# Altium schematic sheet control_circuit.SchDoc
size A0; SheetNumber: 1; SheetTotal: 1
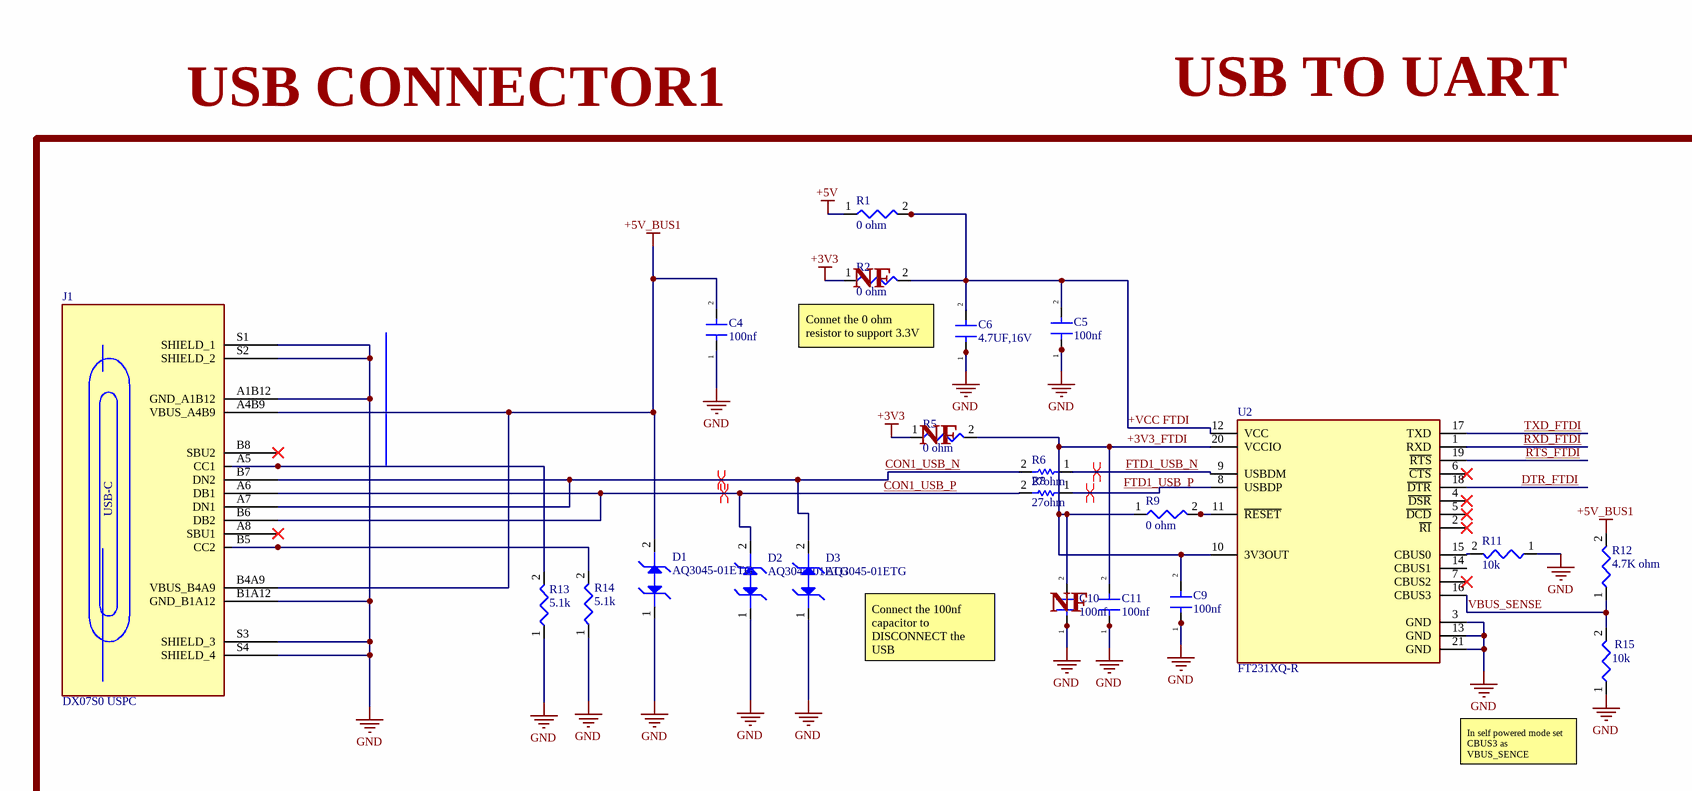
[diagram p0: control_circuit.SchDoc, top left]
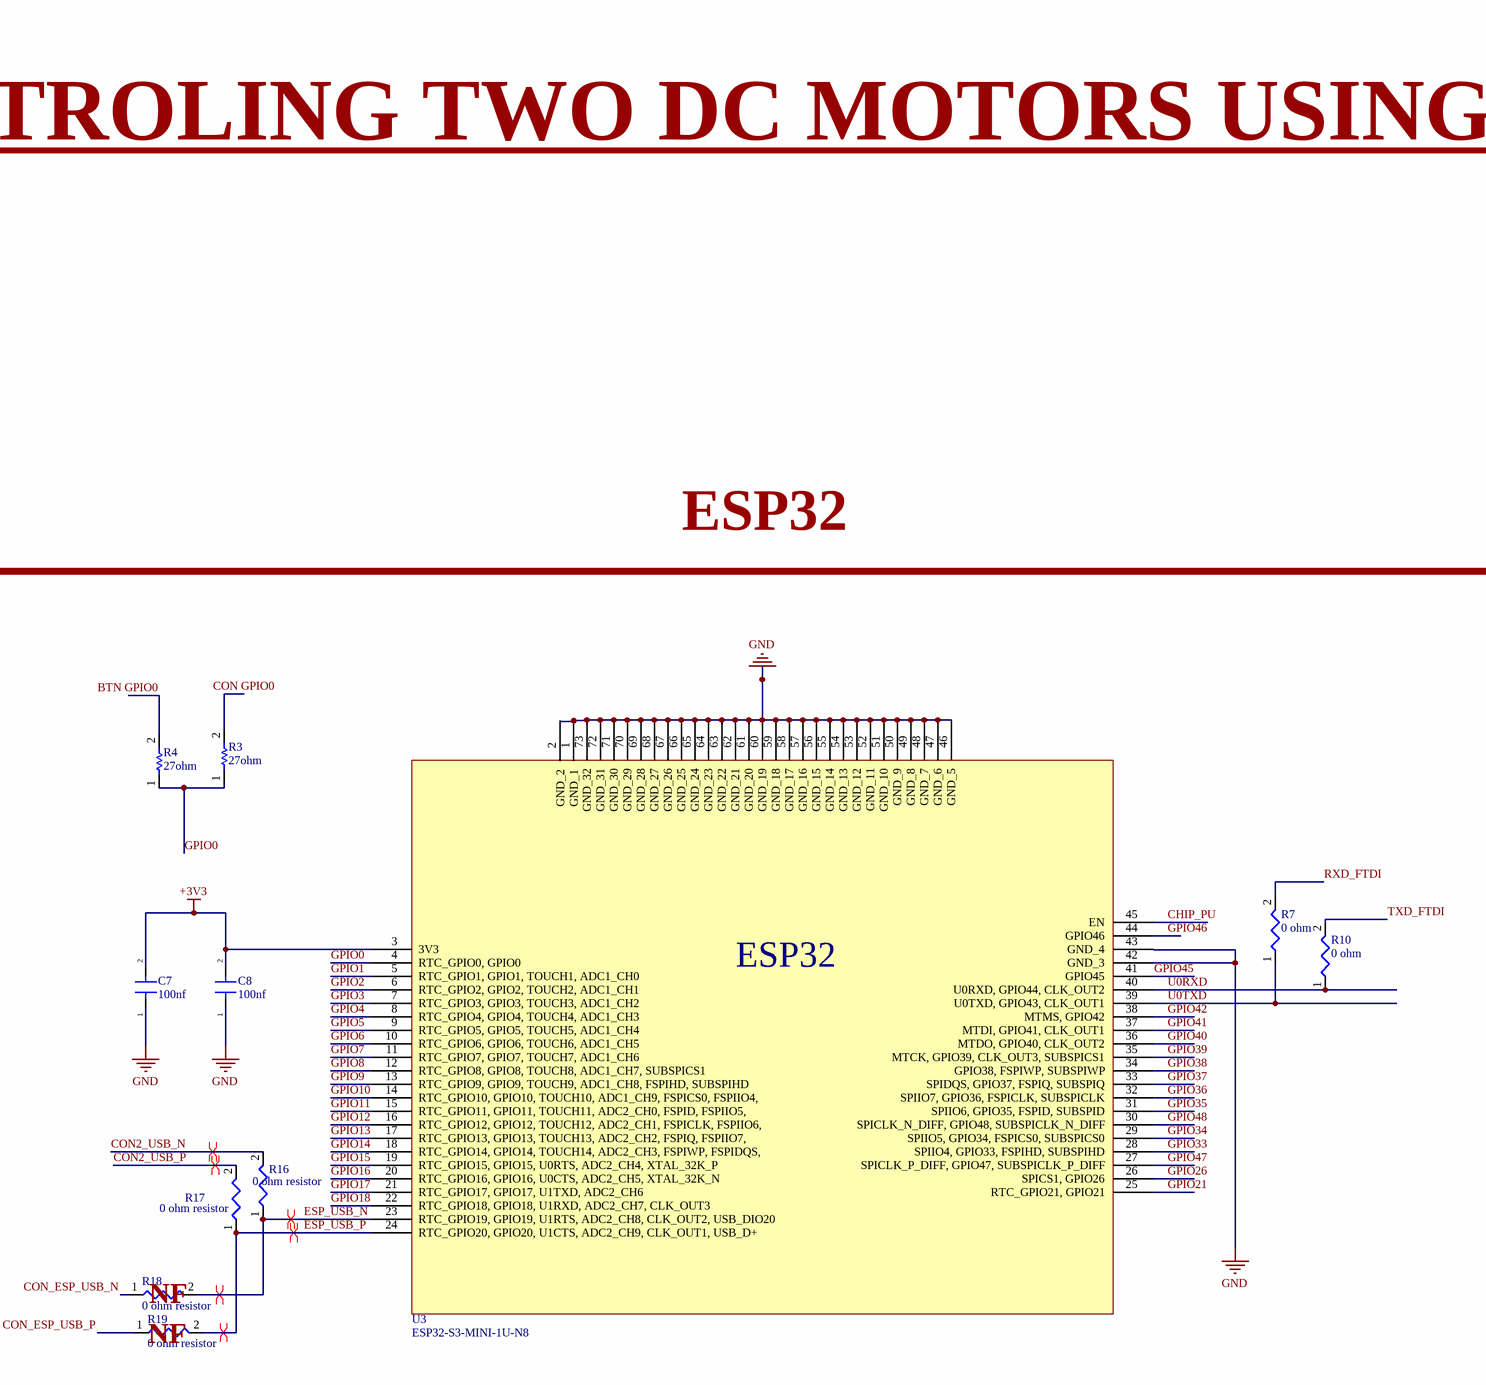
[diagram p1: control_circuit.SchDoc, top middle]
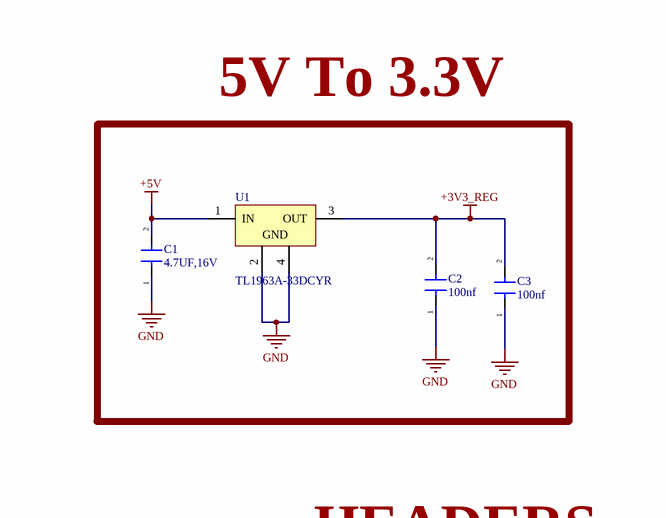
[diagram p2: control_circuit.SchDoc, top right]
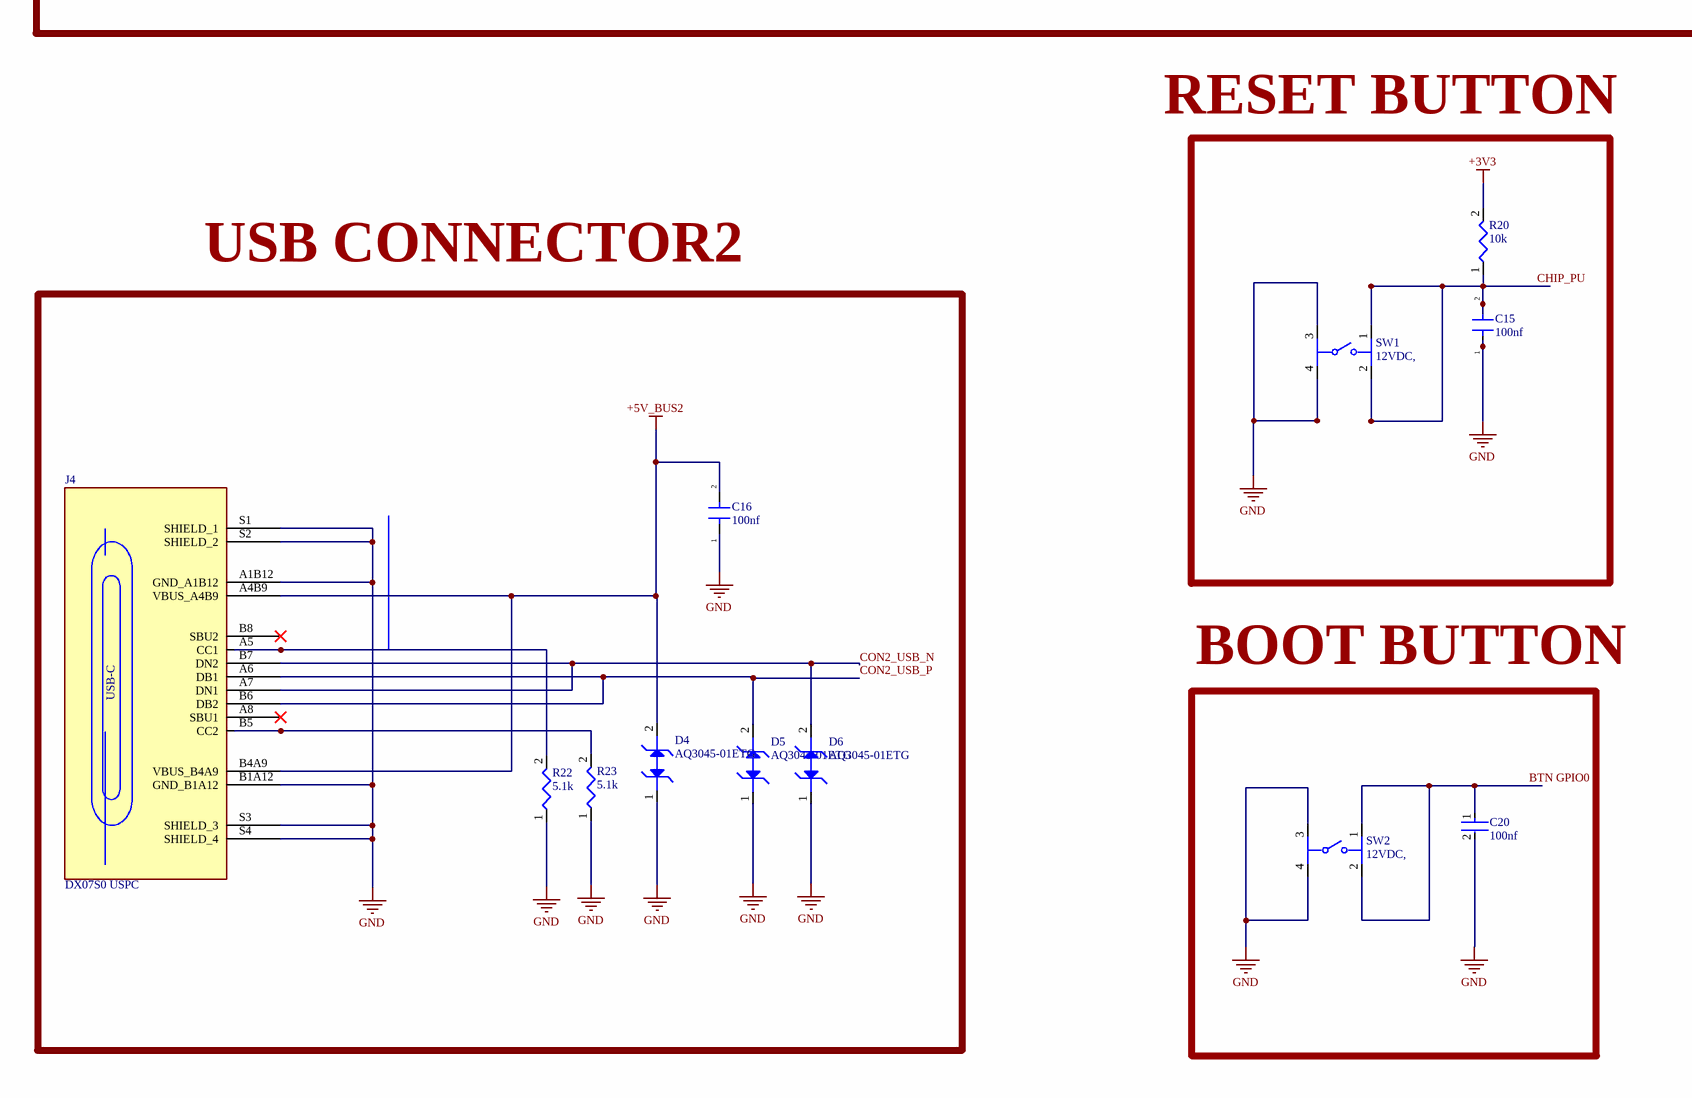
[diagram p3: control_circuit.SchDoc, bottom left]
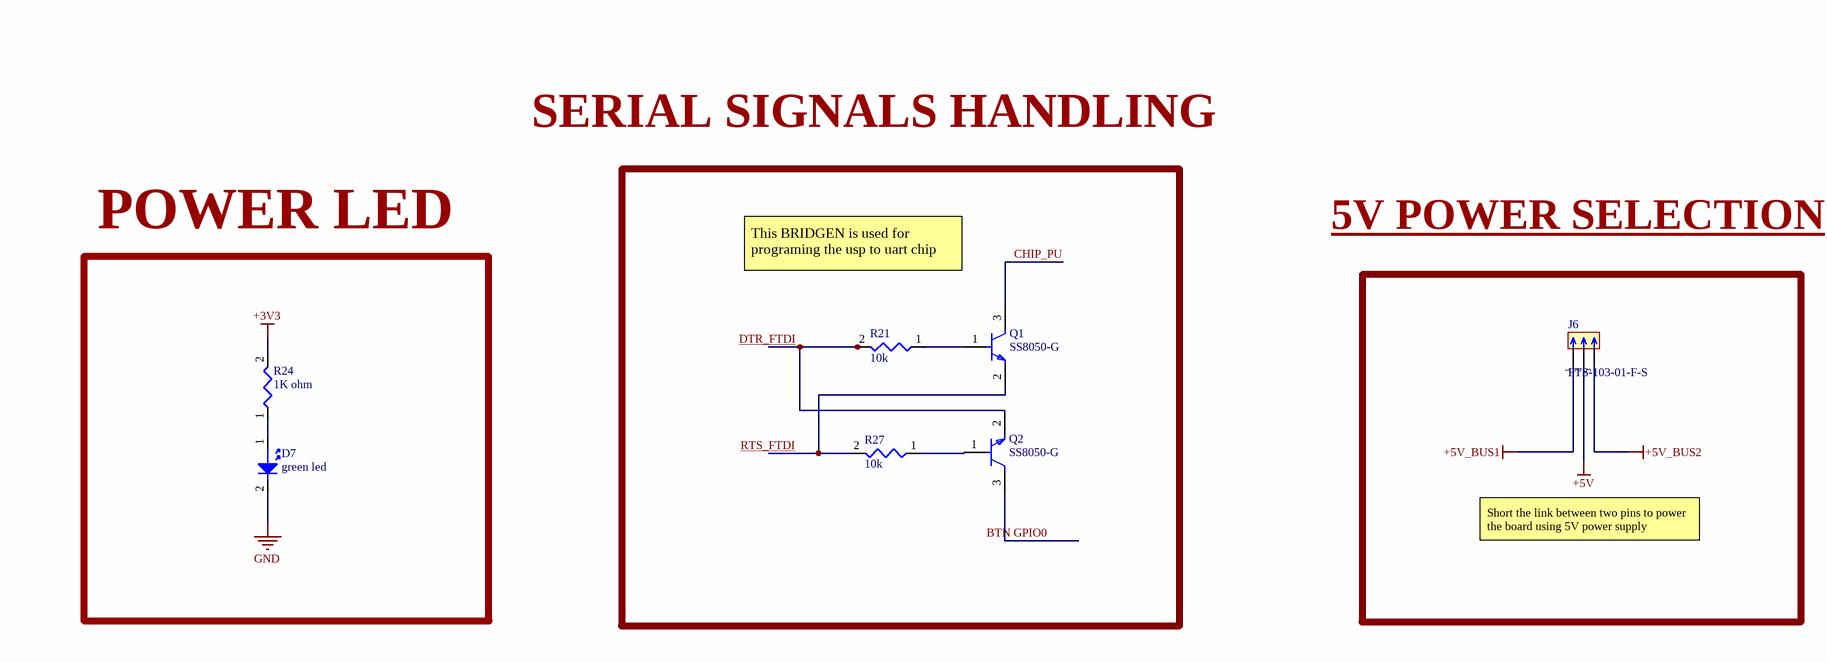
[diagram p4: control_circuit.SchDoc, bottom middle]
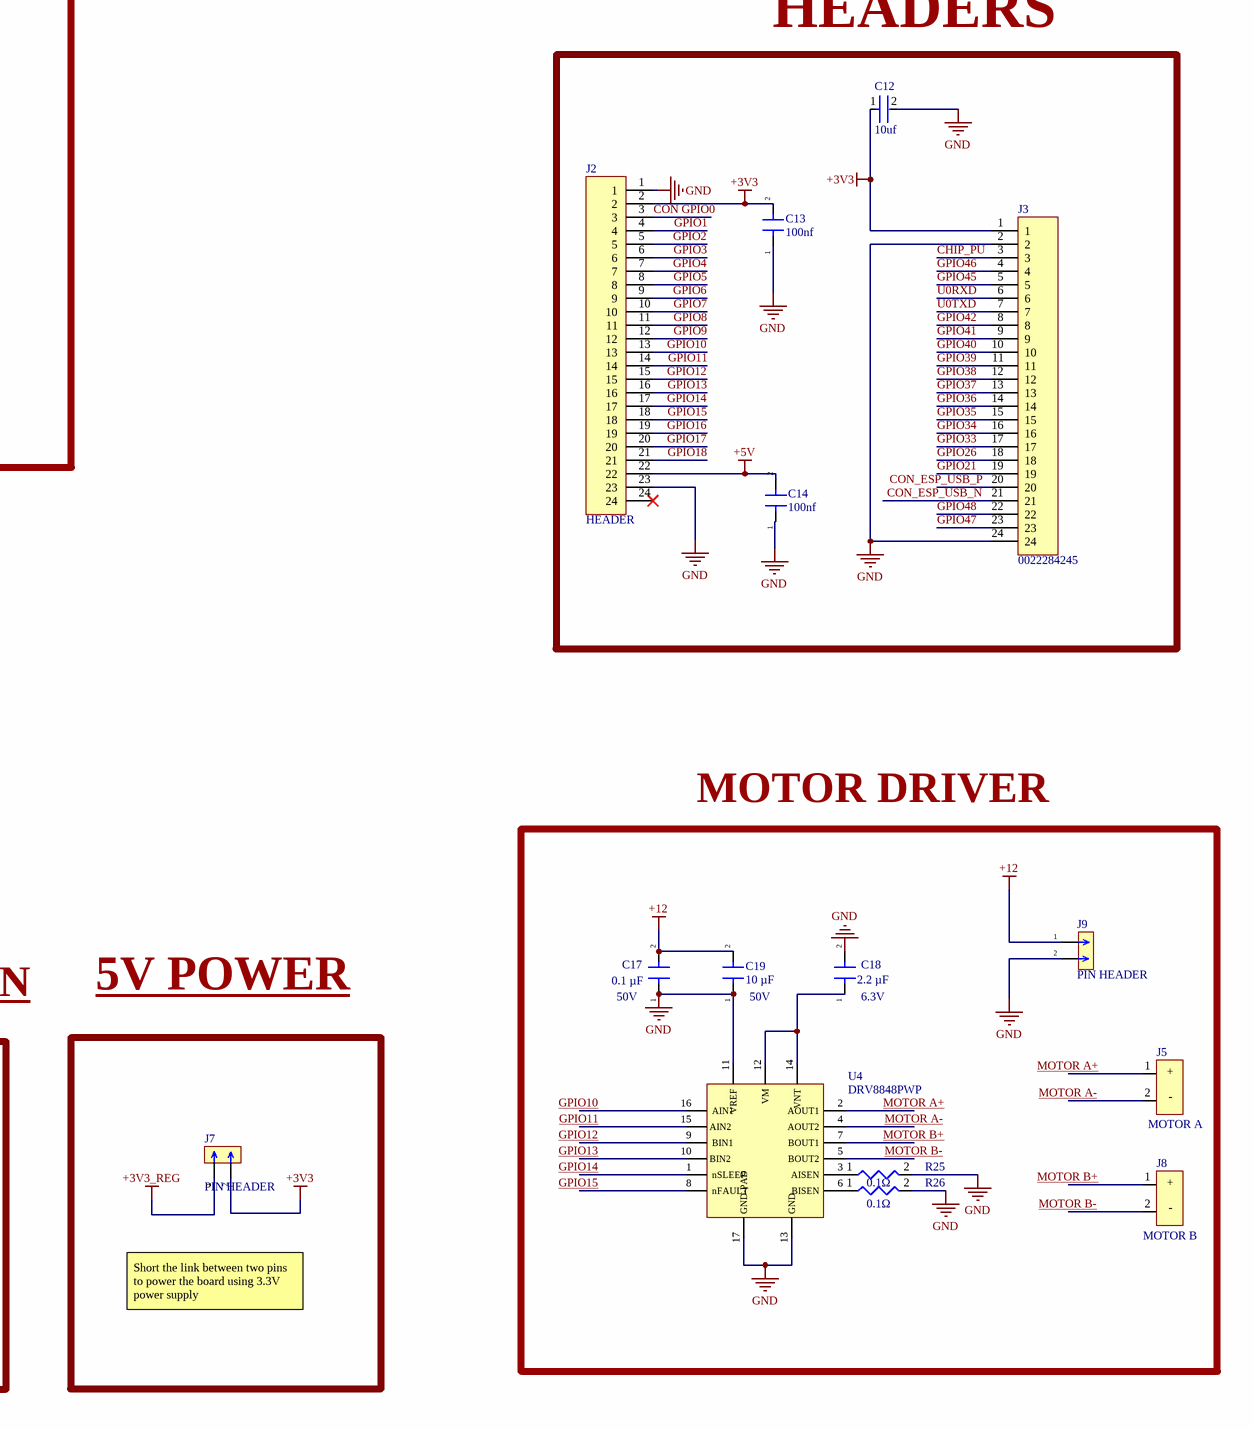
[diagram p5: control_circuit.SchDoc, bottom right]

## Parts
C1  4.7UF,16V  [4.7uf_capacitor]
C2  100nf  [0603 capacitor]
C3  100nf  [0603 capacitor]
C4  100nf  [0603 capacitor]
C5  100nf  [0603 capacitor]
C6  4.7UF,16V  [4.7uf_capacitor]
C7  100nf  [0603 capacitor]
C8  100nf  [0603 capacitor]
C9  100nf  [0603 capacitor]
C10  100nf  [0603 capacitor]
C11  100nf  [0603 capacitor]
C12  10uf  [FP-CL17-IPC_C]
C13  100nf  [0603 capacitor]
C14  100nf  [0603 capacitor]
C15  100nf  [0603 capacitor]
C16  100nf  [0603 capacitor]
C17  0.1 µF  [CAP SMD]
C18  2.2 µF  [CAP SMD]
C19  10 µF  [CAP SMD]
C20  100nf  [FP-CL17-IPC_C]
D1  AQ3045-01ETG  [SOD882]
D2  AQ3045-01ETG  [SOD882]
D3  AQ3045-01ETG  [SOD882]
D4  AQ3045-01ETG  [SOD882]
D5  AQ3045-01ETG  [SOD882]
D6  AQ3045-01ETG  [SOD882]
D7  green led  [LED0402G]
J1  DX07S0 USPC  [usp-c]
J2  HEADER  [HDR_1X24_2.54MM]
J3  0022284245  [HDR_1X24_2.54MM]
J4  DX07S0 USPC  [usp-c]
J5  MOTOR A  [header]
J6  FTS-103-01-F-S  [pin header male]
J7  PIN HEADER  [HEADER 1*2]
J8  MOTOR B  [header]
J9  PIN HEADER  [HEADER 1*2]
Q1  SS8050-G  [SS8050-G TRANSISTOR]
Q2  SS8050-G  [SS8050-G TRANSISTOR]
R1  0 ohm  [27ohm resisor smd]
R2  0 ohm  [27ohm resisor smd]
R3  27ohm  [27ohm resisor smd]
R4  27ohm  [27ohm resisor smd]
R5  0 ohm  [27ohm resisor smd]
R6  27ohm  [27ohm resisor smd]
R7  0 ohm  [27ohm resisor smd]
R8  27ohm  [27ohm resisor smd]
R9  0 ohm  [27ohm resisor smd]
R10  0 ohm  [27ohm resisor smd]
R11  10k  [SMD RESISTOR]
R12  4.7K ohm  [27ohm resisor smd]
R13  5.1k  [5.1K resistor smd]
R14  5.1k  [5.1K resistor smd]
R15  10k  [SMD RESISTOR]
R16  0 ohm resistor  [27ohm resisor smd]
R17  0 ohm resistor  [27ohm resisor smd]
R18  0 ohm resistor  [27ohm resisor smd]
R19  0 ohm resistor  [27ohm resisor smd]
R20  10k  [SMD RESISTOR]
R21  10k  [SMD RESISTOR]
R22  5.1k  [5.1K resistor smd]
R23  5.1k  [5.1K resistor smd]
R24  1K ohm  [5.1K resistor smd]
R25  0.1Ω  [SMD RESISTOR]
R26  0.1Ω  [SMD RESISTOR]
R27  10k  [SMD RESISTOR]
SW1  12VDC,  [tactile switch smd]
SW2  12VDC,  [tactile switch smd]
U1  TL1963A-33DCYR  [TL1963A-33DCYR]
U2  FT231XQ-R  [FT231XQ-R]
U3  ESP32-S3-MINI-1U-N8  [ESP32-S3-MINI-1-N8]
U4  DRV8848PWP  [DRV8848 PWP SMD]

## Blocks framed on the sheet
USB CONNECTOR1: C4-C6 C9-C11 D1-D3 J1 R1 R2 R5 R6 R8 R9 R11-R15 U2
5V To 3.3V: C1-C3 U1
HEADERS: C12-C14 J2 J3
USB CONNECTOR2: C16 D4-D6 J4 R22 R23
MOTOR DRIVER: C17-C19 J5 J8 J9 R25 R26 U4
BOOT BUTTON: C20 SW2
POWER LED: D7 R24

## Nets
+3V3: C7.2 C8.2 C12.1 C13.2 J2.2 J3.1 J7.2 R2.1 R5.1 R20.2 R24.2 U3.3(3V3)
+3V3_REG: C2.2 C3.2 J7.1 U1.3(OUT)
+5V: C1.2 C14.2 J2.22 J6.2 R1.1 U1.1(IN)
+5V_BUS1: C4.2 D1.2 J1.A4B9(VBUS_A4B9) J1.B4A9(VBUS_B4A9) J6.1 R12.2
+5V_BUS2: C16.2 D4.2 J4.A4B9(VBUS_A4B9) J4.B4A9(VBUS_B4A9) J6.3
+12: C17.2 C19.2 J9.1
GND: C1.1 C2.1 C3.1 C4.1 C5.1 C6.1 C7.1 C8.1 C9.1 C10.1 C11.1 C12.2 C13.1 C14.1 C15.1 C16.1 C17.1 C18.2 C19.1 C20.2 D1.1 D2.1 D3.1 D4.1 D5.1 D6.1 D7.2 J1.A1B12(GND_A1B12) J1.B1A12(GND_B1A12) J1.S1(SHIELD_1) J1.S2(SHIELD_2) J1.S3(SHIELD_3) J1.S4(SHIELD_4) J2.1 J2.23 J3.2 J3.24 J4.A1B12(GND_A1B12) J4.B1A12(GND_B1A12) J4.S1(SHIELD_1) J4.S2(SHIELD_2) J4.S3(SHIELD_3) J4.S4(SHIELD_4) J9.2 R11.1 R13.1 R14.1 R15.1 R22.1 R23.1 R25.2 R26.2 SW1.3 SW1.4 SW2.3 SW2.4 U1.2(GND) U1.4(GND) U2.3(GND) U2.13(GND) U2.21(GND) U3.1(GND_1) U3.2(GND_2) U3.42(GND_3) U3.43(GND_4) U3.46(GND_5) U3.47(GND_6) U3.48(GND_7) U3.49(GND_8) U3.50(GND_9) U3.51(GND_10) U3.52(GND_11) U3.53(GND_12) U3.54(GND_13) U3.55(GND_14) U3.56(GND_15) U3.57(GND_16) U3.58(GND_17) U3.59(GND_18) U3.60(GND_19) U3.61(GND_20) U3.62(GND_21) U3.63(GND_22) U3.64(GND_23) U3.65(GND_24) U3.66(GND_25) U3.67(GND_26) U3.68(GND_27) U3.69(GND_28) U3.70(GND_29) U3.71(GND_30) U3.72(GND_31) U3.73(GND_32) U4.11(VREF) U4.13(GND) U4.17(GND-PAD)
+3V3_FTDI: C9.2 C10.2 C11.2 R5.2 R9.1 U2.10(3V3OUT) U2.20(VCCIO)
+VCC FTDI: C5.2 C6.2 R1.2 R2.2 U2.12(VCC)
BTN GPIO0: C20.1 Q2.3(C) R4.2 SW2.1 SW2.2
CHIP_PU: C15.2 J3.3 Q1.3(C) R20.1 SW1.1 SW1.2 U3.45(EN)
CON1_USB_N: D3.2 J1.A7(DN1) J1.B7(DN2) R6.2
CON1_USB_P: D2.2 J1.A6(DB1) J1.B6(DB2) R8.2
CON2_USB_N: D6.2 J4.A7(DN1) J4.B7(DN2) R16.2
CON2_USB_P: D5.2 J4.A6(DB1) J4.B6(DB2) R17.2
CON GPIO0: J2.3 R3.2
CON_ESP_USB_N: J3.21 R18.1
CON_ESP_USB_P: J3.20 R19.1
DTR_FTDI: Q2.2(E) R21.2 U2.18(~{DTR})
ESP_USB_N: R16.1 R18.2 U3.23(RTC_GPIO19,_GPIO19,_U1RTS,_ADC2_CH8,_CLK_OUT2,_USB_DIO20)
ESP_USB_P: R17.1 R19.2 U3.24(RTC_GPIO20,_GPIO20,_U1CTS,_ADC2_CH9,_CLK_OUT1,_USB_D+)
FTD1_USB_N: R6.1 U2.9(USBDM)
FTD1_USB_P: R8.1 U2.8(USBDP)
GPIO0: R3.1 R4.1 U3.4(RTC_GPIO0,_GPIO0)
GPIO1: J2.4 U3.5(RTC_GPIO1,_GPIO1,_TOUCH1,_ADC1_CH0)
GPIO2: J2.5 U3.6(RTC_GPIO2,_GPIO2,_TOUCH2,_ADC1_CH1)
GPIO3: J2.6 U3.7(RTC_GPIO3,_GPIO3,_TOUCH3,_ADC1_CH2)
GPIO4: J2.7 U3.8(RTC_GPIO4,_GPIO4,_TOUCH4,_ADC1_CH3)
GPIO5: J2.8 U3.9(RTC_GPIO5,_GPIO5,_TOUCH5,_ADC1_CH4)
GPIO6: J2.9 U3.10(RTC_GPIO6,_GPIO6,_TOUCH6,_ADC1_CH5)
GPIO7: J2.10 U3.11(RTC_GPIO7,_GPIO7,_TOUCH7,_ADC1_CH6)
GPIO8: J2.11 U3.12(RTC_GPIO8,_GPIO8,_TOUCH8,_ADC1_CH7,_SUBSPICS1)
GPIO9: J2.12 U3.13(RTC_GPIO9,_GPIO9,_TOUCH9,_ADC1_CH8,_FSPIHD,_SUBSPIHD)
GPIO10: J2.13 U3.14(RTC_GPIO10,_GPIO10,_TOUCH10,_ADC1_CH9,_FSPICS0,_FSPIIO4,) U4.16(AIN1)
GPIO11: J2.14 U3.15(RTC_GPIO11,_GPIO11,_TOUCH11,_ADC2_CH0,_FSPID,_FSPIIO5,) U4.15(AIN2)
GPIO12: J2.15 U3.16(RTC_GPIO12,_GPIO12,_TOUCH12,_ADC2_CH1,_FSPICLK,_FSPIIO6,) U4.9(BIN1)
GPIO13: J2.16 U3.17(RTC_GPIO13,_GPIO13,_TOUCH13,_ADC2_CH2,_FSPIQ,_FSPIIO7,) U4.10(BIN2)
GPIO14: J2.17 U3.18(RTC_GPIO14,_GPIO14,_TOUCH14,_ADC2_CH3,_FSPIWP,_FSPIDQS,) U4.1(nSLEEP)
GPIO15: J2.18 U3.19(RTC_GPIO15,_GPIO15,_U0RTS,_ADC2_CH4,_XTAL_32K_P) U4.8(nFAULT)
GPIO16: J2.19 U3.20(RTC_GPIO16,_GPIO16,_U0CTS,_ADC2_CH5,_XTAL_32K_N)
GPIO17: J2.20 U3.21(RTC_GPIO17,_GPIO17,_U1TXD,_ADC2_CH6)
GPIO18: J2.21 U3.22(RTC_GPIO18,_GPIO18,_U1RXD,_ADC2_CH7,_CLK_OUT3)
GPIO21: J3.19 U3.25(RTC_GPIO21,_GPIO21)
GPIO26: J3.18 U3.26(SPICS1,_GPIO26)
GPIO33: J3.17 U3.28(SPIIO4,_GPIO33,_FSPIHD,_SUBSPIHD)
GPIO34: J3.16 U3.29(SPIIO5,_GPIO34,_FSPICS0,_SUBSPICS0)
GPIO35: J3.15 U3.31(SPIIO6,_GPIO35,_FSPID,_SUBSPID)
GPIO36: J3.14 U3.32(SPIIO7,_GPIO36,_FSPICLK,_SUBSPICLK)
GPIO37: J3.13 U3.33(SPIDQS,_GPIO37,_FSPIQ,_SUBSPIQ)
GPIO38: J3.12 U3.34(GPIO38,_FSPIWP,_SUBSPIWP)
GPIO39: J3.11 U3.35(MTCK,_GPIO39,_CLK_OUT3,_SUBSPICS1)
GPIO40: J3.10 U3.36(MTDO,_GPIO40,_CLK_OUT2)
GPIO41: J3.9 U3.37(MTDI,_GPIO41,_CLK_OUT1)
GPIO42: J3.8 U3.38(MTMS,_GPIO42)
GPIO45: J3.5 U3.41(GPIO45)
GPIO46: J3.4 U3.44(GPIO46)
GPIO47: J3.23 U3.27(SPICLK_P_DIFF,_GPIO47,_SUBSPICLK_P_DIFF)
GPIO48: J3.22 U3.30(SPICLK_N_DIFF,_GPIO48,_SUBSPICLK_N_DIFF)
MOTOR A+: J5.1 U4.2(AOUT1)
MOTOR A-: J5.2 U4.4(AOUT2)
MOTOR B+: J8.1 U4.7(BOUT1)
MOTOR B-: J8.2 U4.5(BOUT2)
RTS_FTDI: Q1.2(E) R27.2 U2.19(~{RTS})
RXD_FTDI: R7.2 U2.1(RXD)
TXD_FTDI: R10.2 U2.17(TXD)
U0RXD: J3.6 R10.1 U3.40(U0RXD,_GPIO44,_CLK_OUT2)
U0TXD: J3.7 R7.1 U3.39(U0TXD,_GPIO43,_CLK_OUT1)
VBUS_SENSE: R12.1 R15.2 U2.16(CBUS3)
NetC18_1: C18.1 U4.12(VM) U4.14(VNT)
NetD7_1: D7.1 R24.1
NetJ1_A5: J1.A5(CC1) R13.2
NetJ1_B5: J1.B5(CC2) R14.2
NetJ4_A5: J4.A5(CC1) R22.2
NetJ4_B5: J4.B5(CC2) R23.2
NetQ1_1: Q1.1(B) R21.1
NetQ2_1: Q2.1(B) R27.1
NetR9_2: R9.2 U2.11(~{RESET})
NetR11_2: R11.2 U2.15(CBUS0)
NetR25_1: R25.1 U4.3(AISEN)
NetR26_1: R26.1 U4.6(BISEN)

Not connected (* = marked no-connect by the designer): J1 A8(SBU1)* B8(SBU2)*; J2 24*; J4 A8(SBU1)* B8(SBU2)*; U2 2(~{RI})* 4(~{DSR})* 5(~{DCD})* 6(~{CTS})* 7(CBUS2)* 14(CBUS1)

## Layout directives
differential pair; differential pair class DIFF90: CON1_USB_N, CON1_USB_P, CON2_USB_N, CON2_USB_P, ESP_USB_N, ESP_USB_P, FTD1_USB_N, FTD1_USB_P

## Notes on the sheet
- CONTROLING TWO DC MOTORS USING ESP32
- USB TO UART
- ESP32
- (near R2) NF
- Connet the 0 ohm resistor to support 3.3V
- (near R5) NF
- (near C10) NF
- Connect the 100nf capacitor to DISCONNECT the USB
- In self powered mode set CBUS3 as VBUS_SENCE
- (near R19) NF
- (near R18) NF
- RESET BUTTON
- SERIAL SIGNALS HANDLING
- This BRIDGEN is used for programing the usp to uart chip
- 5V POWER SELECTION
- 5V POWER
- (near C17) 50V
- (near C19) 50V
- (near C18) 6.3V
- Short the link between two pins to power the board using 5V power supply
- Short the link between two pins to power the board using 3.3V power supply
- (in symbol DX07S0 USPC) USB-C
- (in symbol ESP32-S3-MINI-1U-N8) ESP32
- (in symbol terminal block_TH) +; -

## Library data of the parts
C1 C6 = CL05A475MO5NUNC: CAP CER 4.7UF 16V X5R 0402; Manufacturer: Samsung; Dielectric Material: Ceramic; Multilayer: Yes; Tolerance  (fill in as +-): 20%; Description: Ceramic Capacitor, Multilayer, Ceramic, 16V, 20% +Tol, 20% -Tol, X5R, 15% TC, 4.7uF, Surface Mount, 0402; Supplier: Digikey; Supplier Part Number: 1276-6836-6-ND; Manufacturer Part Number: CL05A475MO5NUNC; RoHS: Yes; Category: Ceramic Capacitors; Stock: 91699; Pricing: 1=0.45, 10=0.268, 50=0.1948, 100=0.1721, 500=0.1333, 1000=0.12121, 2500=0.10837, 5000=0.10058 (USD); Mounting Technology: Surface Mount; Pins: 2; Package Shape: Rectangular; Case/Package: 0402; Terminal Finish: Nickel; Min Operating Temperature: -55°C; Max Operating Temperature: 85°C; JESD-609 Code: e3; Value: 4.7uF; Capacitor Type: Ceramic; Package Style: SMTMeter; Packaging: Tape and Reel; Tolerance (fill in as +-): 20%; Rated DC Voltage (URdc): 16V; Temperature Characteristics Code: X5R; Termination: Wraparound; Length: 1mm; Width: 0.5mm; Height: 0.7mm; Reach SVHC Compliant: Yes; RoHS Compliant: Yes; ComponentLink1URL: https://datasheet.ciiva.com:443/pdfs/VipMasterIC/IC/SEMS/SEMS-S-A0008384515/SEMS-S-A0008898881-1.pdf?src-supplier=IHS+Markit; ComponentLink1Description: https://datasheet.ciiva.com:443/pdfs/VipMasterIC/IC/SEMS/SEMS-S-A0008384515/SEMS-S-A0008898881-1.pdf?src-supplier=IHS+Markit; ComponentLink2URL: http://www.farnell.com/datasheets/2710653.pdf?src-supplier=Farnell; ComponentLink2Description: http://www.farnell.com/datasheets/2710653.pdf?src-supplier=Farnell; ComponentLink3URL: http://www.samsungsem.com/kr/support/product-search/mlcc/CL05A475MO5NUNC.jsp?src-supplier=Digikey; ComponentLink3Description: http://www.samsungsem.com/kr/support/product-search/mlcc/CL05A475MO5NUNC.jsp?src-supplier=Digikey; ComponentLink4URL: http://www.farnell.com/datasheets/2710653.pdf?src-supplier=Newark; ComponentLink4Description: http://www.farnell.com/datasheets/2710653.pdf?src-supplier=Newark; ComponentLink5URL: http://www.farnell.com/datasheets/2710653.pdf?src-supplier=Element14; ComponentLink5Description: http://www.farnell.com/datasheets/2710653.pdf?src-supplier=Element14; ComponentLink6URL: https://datasheet.octopart.com/CL05A475MO5NUNC-Samsung-Electro-Mechanics-datasheet-123102911.pdf?src-supplier=Future+Electronics; ComponentLink6Description: https://datasheet.octopart.com/CL05A475MO5NUNC-Samsung-Electro-Mechanics-datasheet-123102911.pdf?src-supplier=Future+Electronics
C2-C5 C7-C11 C13-C16 = C0603C102K5RECTU: Ceramic Capacitor, Multilayer, Ceramic, 50V, 10% +Tol, 10% -Tol, X7R, 15% TC, 0.001uF, Surface Mount, 0402; Manufacturer: KEMET; Manufacturer Part Number: C0402C102K5RECTU; Supplier: Digikey; Supplier Part Number: 399-C0402C102K5RECTUCT-ND; RoHS: Yes; Stock: 8816; Pricing: 1=0.1, 10=0.046, 50=0.0314, 100=0.0269, 500=0.0194, 1000=0.01706, 2500=0.01458, 5000=0.01308 (USD); Pins: 2; Dielectric Material: Ceramic; Capacitor Type: Ceramic; Reach SVHC Compliant: Yes; RoHS Compliant: Yes; ComponentLink1URL: https://datasheet.ciiva.com:443/pdfs/VipMasterIC/IC/KEME/KEME-S-A0008958450/KEME-S-A0008958450-1.pdf?src-supplier=IHS+Markit; ComponentLink1Description: https://datasheet.ciiva.com:443/pdfs/VipMasterIC/IC/KEME/KEME-S-A0008958450/KEME-S-A0008958450-1.pdf?src-supplier=IHS+Markit
C12 C20 = CMP-13271-001069-1: Cap Ceramic 100nF 10V X7R ±10% SMD 0402 +125°C Paper T/R; Height: 0.5mm; Case/Package: 0402; Contact Plating: Tin; Case Code (Imperial): 0402; Capacitance: 100nF; Thickness: 0.022inch; Min Operating Temperature: -55°C; Package Quantity: 1; Length: 1mm; Max Operating Temperature: 125°C; Depth: 0.5mm; Voltage Rating: 10V; Packaging: Tape and Reel; Mount: Surface Mount; Tolerance: 10%; Width: 0.02inch; Radiation Hardening: No; Case Code (Metric): 1005; Dielectric: X7R
C17-C19 = capacitor smd: 22 µF ±20% 6.3V Ceramic Capacitor X5R 0603 (1608 Metric)
D1-D6 = AQ3045-01ETG: TVS DIODE 5.3VWM 12VC SOD882; Manufacturer: Littelfuse; Number of Bidirectional Channels: 1; Reverse Standoff Voltage: 5.3V; Min Breakdown Voltage: 6.8V; Peak Pulse Current: 3A; Peak Pulse Power: 40W; Power Line Protection: No; Diode Type: ZENER; Leakage Current: 100nA; Number of Channels: 1NUMBER; Description: TVS DIODE 12VC 3A SOD882 / ESD Suppressor TVS Bi-Dir 5.3V Automotive 2-Pin SOD-882 T/R; Supplier: Digikey; Supplier Part Number: F9321DKR-ND; Manufacturer Part Number: AQ3045-01ETG; RoHS: Yes; Category: TVS Diodes; Stock: 20579; Pricing: 1=0.5, 10=0.391, 100=0.2344, 500=0.217, 1000=0.14756, 2000=0.13585, 5000=0.1302 (USD); Mounting Technology: Surface Mount; Min Operating Temperature: -55°C; Max Operating Temperature: 150°C; Packaging: Cut Tape; Series: Automotive, AEC-Q101, AQ3045, SPA®; Operating Supply Voltage: 5.3V; RoHS Compliant: Yes; ComponentLink1URL: https://www.littelfuse.com/~/media/electronics/datasheets/tvs_diode_arrays/littelfuse_tvs_diode_array_aq3045_datasheet.pdf.pdf?src-supplier=Digikey; ComponentLink1Description: https://www.littelfuse.com/~/media/electronics/datasheets/tvs_diode_arrays/littelfuse_tvs_diode_array_aq3045_datasheet.pdf.pdf?src-supplier=Digikey; ComponentLink2URL: http://www.littelfuse.com/~/media/electronics/datasheets/tvs_diode_arrays/littelfuse_tvs_diode_array_aq3045_datasheet.pdf.pdf?src-supplier=Digikey; ComponentLink2Description: http://www.littelfuse.com/~/media/electronics/datasheets/tvs_diode_arrays/littelfuse_tvs_diode_array_aq3045_datasheet.pdf.pdf?src-supplier=Digikey
D7 = VLMG1500-GS08: Single Color LED, Yellow Green, 0.5mm; Manufacturer: Vishay; Color: Green,Yellow; Shape: Rectangular; Forward Current: 30mA; Forward Voltage: 2.4V; Luminous Intensity-Nom: 90mcd; Channels: 1; Reverse Voltage-Max: 5V; Viewing Angle: 130°; Overall Height: 0.35mm; Supplier: Digikey; Supplier Part Number: VLMG1500-GS08CT-ND; Manufacturer Part Number: VLMG1500-GS08; RoHS: Yes; Category: LEDs; Stock: 90862; Pricing: 1=0.34, 10=0.265, 100=0.119, 500=0.10746, 1000=0.08827 (USD); Mounting Technology: Surface Mount; Pins: 2; Color@wavelength: Green; Min Operating Temperature: -30°C; Max Operating Temperature: 85°C; Optoelectronic Device Type: SINGLE COLOR LED; Packaging: Tape and Reel; Size: 0.5mm; Terminal Pitch: 0.95mm; Reach SVHC Compliant: Yes; RoHS Compliant: Yes; ComponentLink1URL: https://datasheet.ciiva.com:443/pdfs/VipMasterIC/IC/VISH/VISH-S-A0003457490/VISH-S-A0003457490-1.pdf?src-supplier=IHS+Markit; ComponentLink1Description: https://datasheet.ciiva.com:443/pdfs/VipMasterIC/IC/VISH/VISH-S-A0003457490/VISH-S-A0003457490-1.pdf?src-supplier=IHS+Markit; ComponentLink2URL: https://datasheet.ciiva.com/12071/vlmo1500-244705-12071911.pdf?src-supplier=Mouser; ComponentLink2Description: https://datasheet.ciiva.com/12071/vlmo1500-244705-12071911.pdf?src-supplier=Mouser; ComponentLink3URL: https://datasheet.ciiva.com/30005/vlmo1500-30005134.pdf?src-supplier=Avnet; ComponentLink3Description: https://datasheet.ciiva.com/30005/vlmo1500-30005134.pdf?src-supplier=Avnet
J1 J4 = DX07S0 USPC: JAEDX07S016JA3R1500 1500 Pcs/reel; Manufacturer: JAE Electronics; Supplier: Digikey; Supplier Part Number: 670-DX07S016JA3R1500CT-ND; Manufacturer Part Number: DX07S016JA3R1500; RoHS: No; Category: USB Connectors; Stock: 3411; Pricing: 1=2.48, 10=1.891, 25=1.702, 50=1.5738, 100=1.4574, 250=1.31956, 500=1.22648 (USD); ComponentLink1URL: https://www.jae.com/direct/topics/topics_file_download/?topics_id=91780&amp;ext_no=04&amp;_lang=en&amp;v=2020041313384666992409&src-supplier=Digikey; ComponentLink1Description: https://www.jae.com/direct/topics/topics_file_download/?topics_id=91780&amp;ext_no=04&amp;_lang=en&amp;v=2020041313384666992409&src-supplier=Digikey
J2 J3 = 0022284245: CONN HEADER VERT 24POS 2.54MM; Manufacturer: Molex; Connector Type: BOARD CONNECTOR; Option: General Purpose; Filter Feature: No; Mating Information: MULTIPLE MATING PARTS AVAILABLE; Number of Rows Loaded: 1; Number of Contacts: 24; Description: Board Connector, 24 Contact(s), 1 Row(s), Male, Straight, Solder Terminal; Supplier: Digikey; Supplier Part Number: 900-0022284245-ND; Manufacturer Part Number: 0022284245; RoHS: Yes; Category: Uncategorized; Stock: 2909; Pricing: 1=1.45, 10=1.091, 100=0.8495, 500=0.73094, 1000=0.68963, 5000=0.61174, 10000=0.58469 (USD); Mounting Technology: Board; Contact Material: Brass; Contact Finish - Mating: GOLD; Contact Finish - Termination: Tin (Sn); JESD-609 Code: e3; Contact Gender: Male; Mixed Contacts: No; Mounting Style: STRAIGHT; Termination: Solder; Terminal Pitch: 2.54mm; Flammability Rating: UL94 V-0; DIN Conformance: No; IEC Conformance: No; MIL Conformance: No; Reach SVHC Compliant: Yes; RoHS Compliant: Yes; ComponentLink1URL: https://datasheet.ciiva.com:443/pdfs/VipMasterIC/IC/MOLE/MOLE-S-A0006764423/MOLE-S-A0006877704-1.pdf?src-supplier=IHS+Markit; ComponentLink1Description: https://datasheet.ciiva.com:443/pdfs/VipMasterIC/IC/MOLE/MOLE-S-A0006764423/MOLE-S-A0006877704-1.pdf?src-supplier=IHS+Markit; ComponentLink2URL: https://datasheet.ciiva.com/6814/022284363-sd-6814049.pdf?src-supplier=Digikey; ComponentLink2Description: https://datasheet.ciiva.com/6814/022284363-sd-6814049.pdf?src-supplier=Digikey; ComponentLink3URL: https://datasheet.ciiva.com/10075/0022284245-pcb-headers-10075617.pdf?src-supplier=Avnet; ComponentLink3Description: https://datasheet.ciiva.com/10075/0022284245-pcb-headers-10075617.pdf?src-supplier=Avnet; ComponentLink4URL: https://datasheet.ciiva.com/5153/0022284245-pcb-headers-228340-5153875.pdf?src-supplier=Mouser; ComponentLink4Description: https://datasheet.ciiva.com/5153/0022284245-pcb-headers-228340-5153875.pdf?src-supplier=Mouser; ComponentLink5URL: https://datasheet.ciiva.com/1433/1597854-1433759.pdf?src-supplier=Element14; ComponentLink5Description: https://datasheet.ciiva.com/1433/1597854-1433759.pdf?src-supplier=Element14
J5 J8 = terminal block_TH
J6 = FTS-103-01-F-S: CONN HEADER VERT 3POS 1.27MM; Manufacturer: Samtec; Manufacturer Series: FTS; Connector Type: BOARD CONNECTOR; Option: General Purpose; Additional Feature: Low Profile; Filter Feature: No; Number of Rows Loaded: 1; Number of Contacts: 3; Description: Board Connector, 3 Contact(s), 1 Row(s), Male, Straight, Solder Terminal; Supplier: Digikey; Supplier Part Number: 612-FTS-103-01-F-S-ND; Manufacturer Part Number: FTS-103-01-F-S; RoHS: Yes; Category: Connectors; Stock: 2922; Pricing: 1=0.73, 50=0.6378, 100=0.5407, 500=0.4491, 1000=0.4 (USD); Mounting Technology: Board; Contact Material: Bronze; Contact Finish - Mating: GOLD (3) OVER NICKEL (50); Contact Finish - Termination: Matte Tin (Sn) - with Nickel (Ni) barrier; JESD-609 Code: e3; Contact Gender: Male; Mixed Contacts: No; Mounting Style: STRAIGHT; Termination: Solder; Terminal Pitch: 1.27mm; Flammability Rating: UL94 V-0; DIN Conformance: No; IEC Conformance: No; MIL Conformance: No; Reach SVHC Compliant: Yes; RoHS Compliant: Yes; ComponentLink1URL: https://datasheet.ciiva.com:443/pdfs/VipMasterIC/IC/SAMI/SAMI-S-A0001504673/SAMI-S-A0001504673-1.pdf?src-supplier=IHS+Markit; ComponentLink1Description: https://datasheet.ciiva.com:443/pdfs/VipMasterIC/IC/SAMI/SAMI-S-A0001504673/SAMI-S-A0001504673-1.pdf?src-supplier=IHS+Markit; ComponentLink2URL: http://suddendocs.samtec.com/prints/fts-1xx-xx-xx-xx-xx-mkt.pdf?src-supplier=Digikey; ComponentLink2Description: http://suddendocs.samtec.com/prints/fts-1xx-xx-xx-xx-xx-mkt.pdf?src-supplier=Digikey; ComponentLink3URL: http://www.samtec.com/documents/webfiles/pdf/FTS.pdf?src-supplier=Avnet; ComponentLink3Description: http://www.samtec.com/documents/webfiles/pdf/FTS.pdf?src-supplier=Avnet; ComponentLink4URL: https://datasheet.octopart.com/FTS-103-01-F-S-Samtec-datasheet-116535195.pdf?src-supplier=Toby+Electronics; ComponentLink4Description: https://datasheet.octopart.com/FTS-103-01-F-S-Samtec-datasheet-116535195.pdf?src-supplier=Toby+Electronics; ComponentLink5URL: https://datasheet.octopart.com/FTS-103-01-F-S-Samtec-datasheet-151470456.pdf?src-supplier=Sager+Electronics; ComponentLink5Description: https://datasheet.octopart.com/FTS-103-01-F-S-Samtec-datasheet-151470456.pdf?src-supplier=Sager+Electronics
J7 J9 = FTS-102-01-F-S: Board Connector, 2 Contact(s), 1 Row(s), Male, Straight, Solder Terminal; Manufacturer: Samtec; Manufacturer Series: FTS; Option: General Purpose; Additional Feature: Low Profile; Filter Feature: No; Number of Rows Loaded: 1; Number of Contacts: 2; Supplier: Digikey; Supplier Part Number: SAM15176-ND; Manufacturer Part Number: FTS-102-01-F-S; RoHS: Yes; Category: Connectors; Stock: 835; Pricing: 1=0.49, 50=0.4252, 100=0.3608, 500=0.2994, 1000=0.2625 (USD); Mounting Technology: Board; Contact Material: Bronze; Contact Finish - Mating: GOLD (3) OVER NICKEL (50); Contact Finish - Termination: Matte Tin (Sn) - with Nickel (Ni) barrier; Connector Type: BOARD CONNECTOR; JESD-609 Code: e3; Contact Gender: Male; Mixed Contacts: No; Mounting Style: STRAIGHT; Termination: Solder; Terminal Pitch: 1.27mm; Flammability Rating: UL94 V-0; DIN Conformance: No; IEC Conformance: No; MIL Conformance: No; Reach SVHC Compliant: Yes; RoHS Compliant: Yes; ComponentLink1URL: https://datasheet.ciiva.com:443/pdfs/VipMasterIC/IC/SAMI/SAMI-S-A0001504673/SAMI-S-A0001504673-1.pdf?src-supplier=IHS+Markit; ComponentLink1Description: https://datasheet.ciiva.com:443/pdfs/VipMasterIC/IC/SAMI/SAMI-S-A0001504673/SAMI-S-A0001504673-1.pdf?src-supplier=IHS+Markit; ComponentLink2URL: http://www.samtec.com/documents/webfiles/pdf/FTS.pdf?src-supplier=Avnet; ComponentLink2Description: http://www.samtec.com/documents/webfiles/pdf/FTS.pdf?src-supplier=Avnet
Q1 Q2 = SS8050-G: TRANS NPN 25V 1.5A SOT23-3; Manufacturer: Comchip; Description: Small Signal Bipolar Transistor, 1.5A I(C), 25V V(BR)CEO, 1-Element, NPN, Silicon; Supplier: Digikey; Supplier Part Number: 641-1790-6-ND; Manufacturer Part Number: SS8050-G; RoHS: Yes; Category: Transistors; Stock: 72648; Pricing: 1=0.29, 10=0.2, 100=0.0978, 500=0.08154, 1000=0.05666 (USD); Reach SVHC Compliant: Yes; RoHS Compliant: Yes; ComponentLink1URL: https://datasheet.ciiva.com:443/pdfs/VipMasterIC/IC/COMC/COMC-S-A0004994192/COMC-S-A0004994192-1.pdf?src-supplier=IHS+Markit; ComponentLink1Description: https://datasheet.ciiva.com:443/pdfs/VipMasterIC/IC/COMC/COMC-S-A0004994192/COMC-S-A0004994192-1.pdf?src-supplier=IHS+Markit; ComponentLink2URL: http://www.comchiptech.com/admin/files/product/SS8050-G RevA181526.pdf?src-supplier=Digikey; ComponentLink2Description: http://www.comchiptech.com/admin/files/product/SS8050-G RevA181526.pdf?src-supplier=Digikey
R1 R2 R5 R7 R9 R10 R16-R19 = RC0402JR-070RL: RES 0 OHM JUMPER 1/16W 0402; Manufacturer: Yageo; Power: 62.5mW; Rated Temperature: 70°C; Value: 0R; Package Height: 0.35mm; Package Length: 1mm; Package Width: 0.5mm; Supplier: Digikey; Supplier Part Number: 311-0.0JRCT-ND; Manufacturer Part Number: RC0402JR-070RL; RoHS: Yes; Category: Chip SMD Resistors; Stock: 16266726; Pricing: 1=0.1, 10=0.011, 25=0.0084, 50=0.0064, 100=0.0045, 250=0.00364, 500=0.0029, 1000=0.00214, 5000=0.00154 (USD); Mounting Technology: Surface Mount; Pins: 2; Package Shape: Rectangular; Case/Package: 0402; Terminal Finish: Nickel; Min Operating Temperature: -55°C; Max Operating Temperature: 155°C; JESD-609 Code: e3; Resistor Type: FIXED RESISTOR; Construction: Chip; Package Style: SMTMeter; Packaging: Tape and Reel; Technology: METAL GLAZE/THICK FILM; Termination: Wraparound; Reach SVHC Compliant: Yes; RoHS Compliant: Yes; ComponentLink1URL: https://datasheet.ciiva.com:443/pdfs/VipMasterIC/IC/YAGO/YAGO-S-A0008145938/YAGO-S-A0008145938-1.pdf?src-supplier=IHS+Markit; ComponentLink1Description: https://datasheet.ciiva.com:443/pdfs/VipMasterIC/IC/YAGO/YAGO-S-A0008145938/YAGO-S-A0008145938-1.pdf?src-supplier=IHS+Markit
R3 R4 R6 R8 = RC0402JR-0727RL: Fixed Resistor, Metal Glaze/thick Film, 0.0625W, 27ohm, 50V, 5% +/-Tol, 100ppm/Cel, Surface Mount, 0402; Manufacturer: Yageo; Additional Feature: LASER TRIMMABLE; Power: 62.5mW; Rated Temperature: 70°C; Value: 27R; Temperature Coefficient: 100ppm/°C; Package Height: 0.35mm; Package Length: 1mm; Package Width: 0.5mm; Supplier: Digikey; Supplier Part Number: 311-27JRCT-ND; Manufacturer Part Number: RC0402JR-0727RL; RoHS: Yes; Category: Chip SMD Resistors; Stock: 1760333; Pricing: 1=0.1, 10=0.013, 50=0.0072, 100=0.0058, 500=0.00372, 1000=0.00312, 5000=0.00216 (USD); Mounting Technology: Surface Mount; Pins: 2; Package Shape: Rectangular; Case/Package: 0402; Terminal Finish: Nickel; Min Operating Temperature: -55°C; Max Operating Temperature: 155°C; Tolerance: 5%; JESD-609 Code: e3; Resistor Type: FIXED RESISTOR; Construction: Chip; Package Style: SMTMeter; Packaging: Tape and Reel; Technology: METAL GLAZE/THICK FILM; Termination: Wraparound; Working Voltage: 50V; Reach SVHC Compliant: Yes; RoHS Compliant: Yes; ComponentLink1URL: https://datasheet.ciiva.com:443/pdfs/VipMasterIC/IC/YAGO/YAGO-S-A0008145938/YAGO-S-A0008145938-1.pdf?src-supplier=IHS+Markit; ComponentLink1Description: https://datasheet.ciiva.com:443/pdfs/VipMasterIC/IC/YAGO/YAGO-S-A0008145938/YAGO-S-A0008145938-1.pdf?src-supplier=IHS+Markit; ComponentLink2URL: https://datasheet.ciiva.com/12577/pyu-rc0402-51-rohs-l-6-r-12577469.pdf?src-supplier=Mouser; ComponentLink2Description: https://datasheet.ciiva.com/12577/pyu-rc0402-51-rohs-l-6-r-12577469.pdf?src-supplier=Mouser; ComponentLink3URL: https://datasheet.ciiva.com/7850/1018594-7850188.pdf?src-supplier=Element14; ComponentLink3Description: https://datasheet.ciiva.com/7850/1018594-7850188.pdf?src-supplier=Element14; ComponentLink4URL: https://datasheet.ciiva.com/7850/1018594-7850189.pdf?src-supplier=Element14; ComponentLink4Description: https://datasheet.ciiva.com/7850/1018594-7850189.pdf?src-supplier=Element14
R11 R15 R20 R21 R25-R27 = resistor smd: 10 kOhms ±1% 0.063W, 1/16W Chip Resistor 0402 (1005 Metric) Automotive AEC-Q200, Moisture Resistant Thick Film
R12 = RC0402FR-074K7L: Fixed Resistor, Metal Glaze/thick Film, 0.0625W, 4700ohm, 50V, 1% +/-Tol, 100ppm/Cel, Surface Mount, 0402; Manufacturer: Yageo; Additional Feature: LASER TRIMMABLE; Power: 62.5mW; Rated Temperature: 70°C; Value: 4.7kR; Temperature Coefficient: 100ppm/°C; Package Height: 0.35mm; Package Length: 1mm; Package Width: 0.5mm; Supplier: Digikey; Supplier Part Number: 311-4.7KLRCT-ND; Manufacturer Part Number: RC0402FR-074K7L; RoHS: Yes; Category: Chip SMD Resistors; Stock: 4079848; Pricing: 1=0.1, 10=0.015, 50=0.0088, 100=0.0073, 500=0.00488, 1000=0.00417, 5000=0.00297 (USD); Mounting Technology: Surface Mount; Pins: 2; Package Shape: Rectangular; Case/Package: 0402; Terminal Finish: Nickel; Min Operating Temperature: -55°C; Max Operating Temperature: 155°C; Tolerance: 1%; JESD-609 Code: e3; Resistor Type: FIXED RESISTOR; Construction: Chip; Package Style: SMTMeter; Packaging: Tape and Reel; Technology: METAL GLAZE/THICK FILM; Termination: Wraparound; Working Voltage: 50V; Reach SVHC Compliant: Yes; RoHS Compliant: Yes; ComponentLink1URL: https://datasheet.ciiva.com:443/pdfs/VipMasterIC/IC/YAGO/YAGO-S-A0008145938/YAGO-S-A0008145938-1.pdf?src-supplier=IHS+Markit; ComponentLink1Description: https://datasheet.ciiva.com:443/pdfs/VipMasterIC/IC/YAGO/YAGO-S-A0008145938/YAGO-S-A0008145938-1.pdf?src-supplier=IHS+Markit; ComponentLink2URL: https://datasheet.ciiva.com/22661/1686128-22661342.pdf?src-supplier=Element14; ComponentLink2Description: https://datasheet.ciiva.com/22661/1686128-22661342.pdf?src-supplier=Element14; ComponentLink3URL: https://datasheet.ciiva.com/7850/1018594-7850022.pdf?src-supplier=Element14; ComponentLink3Description: https://datasheet.ciiva.com/7850/1018594-7850022.pdf?src-supplier=Element14; ComponentLink4URL: https://datasheet.ciiva.com/7850/1018594-7850023.pdf?src-supplier=Element14; ComponentLink4Description: https://datasheet.ciiva.com/7850/1018594-7850023.pdf?src-supplier=Element14; ComponentLink5URL: https://datasheet.ciiva.com/15215/getdatasheetpartid-328119-15215035.pdf?src-supplier=Verical; ComponentLink5Description: https://datasheet.ciiva.com/15215/getdatasheetpartid-328119-15215035.pdf?src-supplier=Verical
R13 R14 R22 R23 = AC0402FR-075K1L: Fixed Resistor, Metal Glaze/thick Film, 0.0625W, 5100ohm, 50V, 1% +/-Tol, 100ppm/Cel, Surface Mount, 0402; Manufacturer: Yageo; Additional Feature: LASER TRIMMABLE; Power: 62.5mW; Rated Temperature: 70°C; Value: 5.1kR; Temperature Coefficient: 100ppm/°C; Package Height: 0.32mm; Package Length: 1mm; Package Width: 0.5mm; Reference Standard: AEC-Q200; Supplier: Digikey; Supplier Part Number: YAG3503CT-ND; Manufacturer Part Number: AC0402FR-075K1L; RoHS: Yes; Category: Chip SMD Resistors; Stock: 79765; Pricing: 1=0.1, 10=0.019, 50=0.0116, 100=0.0095, 500=0.00638, 1000=0.00544, 5000=0.00391 (USD); Mounting Technology: Surface Mount; Pins: 2; Package Shape: Rectangular; Case/Package: 0402; Terminal Finish: Nickel; Min Operating Temperature: -55°C; Max Operating Temperature: 155°C; Tolerance: 1%; JESD-609 Code: e3; Resistor Type: FIXED RESISTOR; Construction: Chip; Package Style: SMTMeter; Packaging: Tape and Reel; Technology: METAL GLAZE/THICK FILM; Termination: Wraparound; Working Voltage: 50V; Reach SVHC Compliant: Yes; RoHS Compliant: Yes; ComponentLink1URL: https://datasheet.ciiva.com:443/pdfs/VipMasterIC/IC/YAGO/YAGO-S-A0003597364/YAGO-S-A0003597364-1.pdf?src-supplier=IHS+Markit; ComponentLink1Description: https://datasheet.ciiva.com:443/pdfs/VipMasterIC/IC/YAGO/YAGO-S-A0003597364/YAGO-S-A0003597364-1.pdf?src-supplier=IHS+Markit; ComponentLink2URL: https://datasheet.octopart.com/AC0402FR-075K1L-Yageo-datasheet-166720450.pdf?src-supplier=Future+Electronics; ComponentLink2Description: https://datasheet.octopart.com/AC0402FR-075K1L-Yageo-datasheet-166720450.pdf?src-supplier=Future+Electronics; ComponentLink3URL: http://www.yageo.com/documents/recent/PYu-AC_51_RoHS_L_2_revised.pdf?src-supplier=Future+Electronics; ComponentLink3Description: http://www.yageo.com/documents/recent/PYu-AC_51_RoHS_L_2_revised.pdf?src-supplier=Future+Electronics
R24 = RC0402FR-071KL: RES 1K OHM 1% 1/16W 0402; Manufacturer: Yageo; Additional Feature: LASER TRIMMABLE; Power: 62.5mW; Rated Temperature: 70°C; Value: 1kR; Temperature Coefficient: 100ppm/°C; Working Voltage: 50V; Package Height: 0.35mm; Package Length: 1mm; Package Width: 0.5mm; Supplier: Digikey; Supplier Part Number: 311-1.00KLRCT-ND; Manufacturer Part Number: RC0402FR-071KL; RoHS: Yes; Category: Chip SMD Resistors; Stock: 7200832; Pricing: 1=0.1, 10=0.015, 50=0.0088, 100=0.0073, 500=0.00488, 1000=0.00417, 5000=0.00297 (USD); Mounting Technology: Surface Mount; Pins: 2; Package Shape: Rectangular; Case/Package: 0402; Terminal Finish: Nickel; Min Operating Temperature: -55°C; Max Operating Temperature: 155°C; Tolerance: 1%; JESD-609 Code: e3; Resistor Type: FIXED RESISTOR; Construction: Chip; Package Style: SMTMeter; Packaging: Tape and Reel; Technology: METAL GLAZE/THICK FILM; Termination: Wraparound; Reach SVHC Compliant: Yes; RoHS Compliant: Yes; ComponentLink1URL: https://datasheet.ciiva.com:443/pdfs/VipMasterIC/IC/YAGO/YAGO-S-A0008145938/YAGO-S-A0008145938-1.pdf?src-supplier=IHS+Markit; ComponentLink1Description: https://datasheet.ciiva.com:443/pdfs/VipMasterIC/IC/YAGO/YAGO-S-A0008145938/YAGO-S-A0008145938-1.pdf?src-supplier=IHS+Markit; ComponentLink2URL: https://datasheet.ciiva.com/11819/0900766b80c66297-11819477.pdf?src-supplier=Rs; ComponentLink2Description: https://datasheet.ciiva.com/11819/0900766b80c66297-11819477.pdf?src-supplier=Rs; ComponentLink3URL: https://datasheet.ciiva.com/22747/1018594-22747513.pdf?src-supplier=Element14; ComponentLink3Description: https://datasheet.ciiva.com/22747/1018594-22747513.pdf?src-supplier=Element14; ComponentLink4URL: https://datasheet.ciiva.com/12666/pyu-rc0402-51-rohs-l-6-r-12666741.pdf?src-supplier=Mouser; ComponentLink4Description: https://datasheet.ciiva.com/12666/pyu-rc0402-51-rohs-l-6-r-12666741.pdf?src-supplier=Mouser; ComponentLink5URL: https://datasheet.ciiva.com/17063/pyu-rc0402-51-rohs-l-6-r-17063193.pdf?src-supplier=Future+Electronics; ComponentLink5Description: https://datasheet.ciiva.com/17063/pyu-rc0402-51-rohs-l-6-r-17063193.pdf?src-supplier=Future+Electronics; ComponentLink6URL: https://datasheet.ciiva.com/7983/1018594-7983502.pdf?src-supplier=Element14; ComponentLink6Description: https://datasheet.ciiva.com/7983/1018594-7983502.pdf?src-supplier=Element14; ComponentLink7URL: https://datasheet.ciiva.com/7849/1018594-7849869.pdf?src-supplier=Element14; ComponentLink7Description: https://datasheet.ciiva.com/7849/1018594-7849869.pdf?src-supplier=Element14; ComponentLink8URL: https://datasheet.ciiva.com/7849/1018594-7849871.pdf?src-supplier=Element14; ComponentLink8Description: https://datasheet.ciiva.com/7849/1018594-7849871.pdf?src-supplier=Element14
SW1 SW2 = PTS647SM38SMTR2LFS: Keypad Switch, 1 Switches, SPST, Momentary-tactile, 0.05A, 12VDC, 2.26N, Solder Terminal, Surface Mount-straight; Manufacturer: ITT C&K; Supplier: Digikey; Supplier Part Number: PTS647SM38SMTR2LFSDKR-ND; Manufacturer Part Number: PTS647SM38SMTR2LFS; RoHS: No; Category: Tactile Switches; Stock: 30950; Pricing: 1=0.26, 10=0.249, 25=0.236, 100=0.2138, 250=0.19488, 500=0.18114, 1000=0.15453 (USD); RoHS Compliant: Yes; ComponentLink1URL: https://datasheet.ciiva.com:443/pdfs/VipMasterIC/IC/CKCI/CKCI-S-A0009257890/CKCI-S-A0009257890-1.pdf?src-supplier=IHS+Markit; ComponentLink1Description: https://datasheet.ciiva.com:443/pdfs/VipMasterIC/IC/CKCI/CKCI-S-A0009257890/CKCI-S-A0009257890-1.pdf?src-supplier=IHS+Markit; ComponentLink2URL: https://www.ckswitches.com/media/2567/pts647.pdf?src-supplier=Digikey; ComponentLink2Description: https://www.ckswitches.com/media/2567/pts647.pdf?src-supplier=Digikey
U1 = TL1963A-33DCYR: IC REG LINEAR 3.3V 1.5A SOT223-4; Manufacturer: Texas Instruments; Package Body Material: Plastic; Adjustability: FIXED; Dropout Voltage1-Max: 550mV; Dropout Voltage1-Nom: 340mV; Input Voltage Absolute-Max: 20V; Min Input Voltage: 3.8V; Line Regulation-Max: 0.01%; Load Regulation-Max: 0.07%; Channels: 1; Output Voltage1-Max: 3.4V; Output Voltage1-Min: 3.2V; Regulator Type: FIXED POSITIVE SINGLE OUTPUT LDO REGULATOR; Voltage Tolerance-Max: 3%; Qualification Status: Not Qualified; Description: Fixed Positive LDO Regulator, 3.3V, 0.55V Dropout, BIPolar, PDSO4; Supplier: Digikey; Supplier Part Number: 296-24897-1-ND; Manufacturer Part Number: TL1963A-33DCYR; RoHS: Yes; Category: Voltage Regulators - Linear; Stock: 2176; Pricing: 1=3.15, 10=2.273, 25=2.054, 100=1.8138, 250=1.69916, 500=1.63004, 1000=1.57313 (USD); Case/Package: SOP; Pins: 4; Package Shape: Rectangular; Terminal Finish: Tin; JESD-609 Code: e3; Max Supply Voltage: 20V; JESD-30 Code: R-PDSO-G4; Moisture Sensitivity Level: 2; Number of Outputs: 1; Operating Temperature, TJ-Max: 125°C; Operating Temperature, TJ-Min: -40°C; Output Current1-Max: 1.5A; Output Voltage1-Nom: 3.3V; Package Style: SMALL OUTLINEMeter; Packaging: Tape and Reel; Peak Reflow Temperature (Cel): 260°C; Surface Mount: Yes; Technology: BIPOLAR; Terminal Form: Gull Wing; Terminal Position: DUAL; Length: 6.5mm; Width: 3.5mm; Height - Seated (Max): 1.8mm; Terminal Pitch: 2.3mm; Reach SVHC Compliant: Yes; RoHS Compliant: Yes; ComponentLink1URL: https://www.ti.com:443/lit/ds/symlink/tl1963a.pdf?src-supplier=IHS+Markit; ComponentLink1Description: https://www.ti.com:443/lit/ds/symlink/tl1963a.pdf?src-supplier=IHS+Markit; ComponentLink2URL: https://datasheet.ciiva.com/2046/-2046068.pdf?src-supplier=Digikey; ComponentLink2Description: https://datasheet.ciiva.com/2046/-2046068.pdf?src-supplier=Digikey
U2 = FT231XQ-R: Microprocessor Circuit, CMOS; Manufacturer: FTDI; Power Supplies: 3.3/5V; Max Supply Current: 8.4mA; Max Supply Voltage: 5.5V; Min Supply Voltage: 2.97V; Nominal Supply Voltage: 5V; Qualification Status: Not Qualified; Supplier: Digikey; Supplier Part Number: 768-1128-6-ND; Manufacturer Part Number: FT231XQ-R; RoHS: Yes; Category: Interface ICs; Stock: 61863; Pricing: 1=2.34, 25=2.27, 100=2.2, 250=2, 500=1.82002, 1000=1.7625 (USD); Case/Package: HVQCCN; Pins: 20; Package Shape: Square; Min Operating Temperature: -40°C; Max Operating Temperature: 85°C; JESD-30 Code: S-XQCC-N20; Package Style: CHIP CARRIER, HEAT SINK/SLUG, VERY THIN PROFILEMeter; Surface Mount: Yes; Technology: CMOS; Terminal Form: No Lead; Terminal Position: QUAD; Length: 4mm; Width: 4mm; Height - Seated (Max): 0.8mm; Terminal Pitch: 0.5mm; Temperature Grade: INDUSTRIAL; Reach SVHC Compliant: Yes; RoHS Compliant: Yes; ComponentLink1URL: https://datasheet.ciiva.com:443/pdfs/VipMasterIC/IC/FTDI/FTDIS00099/FTDIS00099-1.pdf?src-supplier=IHS+Markit; ComponentLink1Description: https://datasheet.ciiva.com:443/pdfs/VipMasterIC/IC/FTDI/FTDIS00099/FTDIS00099-1.pdf?src-supplier=IHS+Markit; ComponentLink2URL: https://datasheet.ciiva.com/1787/ds-ft231x-1787312.pdf?src-supplier=Digikey; ComponentLink2Description: https://datasheet.ciiva.com/1787/ds-ft231x-1787312.pdf?src-supplier=Digikey; ComponentLink3URL: https://datasheet.ciiva.com/4787/ds-ft231x-13571-4787570.pdf?src-supplier=Mouser; ComponentLink3Description: https://datasheet.ciiva.com/4787/ds-ft231x-13571-4787570.pdf?src-supplier=Mouser; ComponentLink4URL: https://datasheet.ciiva.com/30475/0900766b811020d3-30475405.pdf?src-supplier=Rs; ComponentLink4Description: https://datasheet.ciiva.com/30475/0900766b811020d3-30475405.pdf?src-supplier=Rs; ComponentLink5URL: https://datasheet.ciiva.com/1787/ft-x-series-1787313.pdf?src-supplier=Digikey; ComponentLink5Description: https://datasheet.ciiva.com/1787/ft-x-series-1787313.pdf?src-supplier=Digikey; ComponentLink6URL: https://datasheet.ciiva.com/1787/ft-x-series-1787314.pdf?src-supplier=Digikey; ComponentLink6Description: https://datasheet.ciiva.com/1787/ft-x-series-1787314.pdf?src-supplier=Digikey
U3 = ESP32-S3-MINI-1U-N8: Manufacturer: Espressif Systems; Supplier: Digikey; Supplier Part Number: 1965-ESP32-S3-MINI-1U-N8CT-ND; Manufacturer Part Number: ESP32-S3-MINI-1U-N8; RoHS: No; Category: LDO; Stock: 2332; Pricing: 1=3.1 (USD)
U4 = DRV8848 SMD: Bipolar Motor Driver Power MOSFET PWM 16-HTSSOP; Manufacturer: Texas Instruments; Current - Output: 4A; Voltage - Supply: 4V ~ 18V; Manufacturer Product Number: DRV8848PWP; Voltage - Load: 4V ~ 18V; Operating Temperature: -40°C ~ 150°C; ComponentLink1Description: datasheet; ComponentLink1URL: https://www.ti.com/general/docs/suppproductinfo.tsp?distId=10&gotoUrl=https%3A%2F%2Fwww.ti.com%2Flit%2Fgpn%2Fdrv8848; Package / Case: 16-PowerTSSOP